# Altium schematic sheet Power.SchDoc
size A4
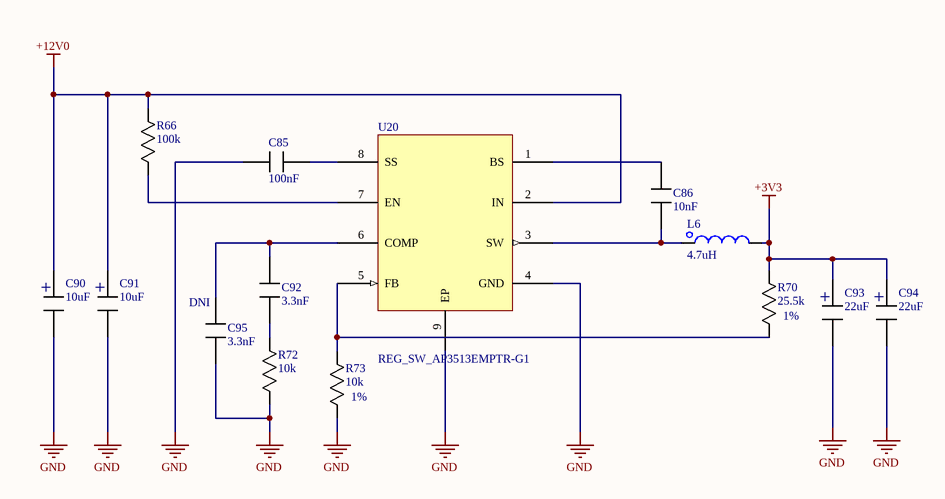
[diagram p0: Power.SchDoc]

## Parts
C85  value 100nF  [0603]  (hidden comment: Capacitor)
C86  value 10nF  [0603]  (hidden comment: Capacitor)
C90  value 10uF  [CAP_RAD_SMD_DIA157]  (hidden comment: Capacitor_Polarized)
C91  value 10uF  [CAP_RAD_SMD_DIA157]  (hidden comment: Capacitor_Polarized)
C92  value 3.3nF  [0603]  (hidden comment: Capacitor)
C93  value 22uF  [CAP_RAD_SMD_DIA157]  (hidden comment: Capacitor_Polarized)
C94  value 22uF  [CAP_RAD_SMD_DIA157]  (hidden comment: Capacitor_Polarized)
C95  value 3.3nF  note: DNI  [0603]  (hidden comment: Capacitor)
L6  value 4.7uH  [SRN5040-4R7M]  (hidden comment: Inductor)
R66  value 100k  [0603]  (hidden comment: Resistor)
R70  value 25.5k  Tolerance: 1%  [0603]  (hidden comment: Resistor)
R72  value 10k  [0603]  (hidden comment: Resistor)
R73  value 10k  Tolerance: 1%  [0603]  (hidden comment: Resistor)
U20  REG_SW_AP3513EMPTR-G1  [AP3513EMPTR-G1]

## Nets
+3V3: C93.+ C94.+ L6.2 R70.1
+12V0: C90.+ C91.+ R66.2 U20.2(IN)
GND: C85.1 C90.- C91.- C93.- C94.- C95.2 R72.2 R73.2 U20.4(GND) U20.9(EP)
NetC85_2: C85.2 U20.8(SS)
NetC86_1: C86.1 U20.1(BS)
NetC86_2: C86.2 L6.1 U20.3(SW)
NetC92_1: C92.1 C95.1 U20.6(COMP)
NetC92_2: C92.2 R72.1
NetR66_1: R66.1 U20.7(EN)
NetR70_2: R70.2 R73.1 U20.5(FB)

## Library data of the parts
C85 = Capacitor: Mfg: Samsung; Mfg_PN: CL10F104ZO8NNNC; HelpURL: *; NI: NI; Supplier1: Digikey; Supplier1_PN: 1276-1258-1-ND; Tolerance: *; Type: *; Rating: *
C86 = Capacitor: Mfg: Samsung; Mfg_PN: CL10B102KB8NNNC; HelpURL: https://www.digikey.ca/product-detail/en/samsung-electro-mechanics/CL10B102KB8NNNC/1276-1018-1-ND/3889104; NI: NI; Supplier1: Digikey; Supplier1_PN: 1276-1018-1-ND; Tolerance: *; Type: *; Rating: *
C90 C91 C93 C94 = Capacitor_Polarized: Capacitor; Mfg: Nichicon; Mfg_PN: UWX1C100MCL1GB; HelpURL: *; NI: *; Supplier1: Digikey; Supplier1_PN: 493-2100-1-ND; Tolerance: *; Type: *; Rating: *
C92 C95 = Capacitor: Mfg: Samsung; Mfg_PN: CL10B332JB8NNNC; HelpURL: *; NI: NI; Supplier1: Digikey; Supplier1_PN: 1276-2030-1-ND; Tolerance: *; Type: *; Rating: *
L6 = Inductor: Mfg: Bourns Inc.; HelpURL: *; Mfg_PN: SRN5040-4R7M; NI: *; Rating: *; Tolerance: *; Supplier1: Digikey; Supplier1_PN: SRN5040-4R7MCT-ND
R66 = Resistor: Mfg: Stackpole Electronics Inc; Mfg_PN: RMCF0603FT100K; HelpURL: https://www.digikey.ca/product-detail/en/stackpole-electronics-inc/RMCF0603FT100K/RMCF0603FT100KCT-ND/1943118; NI: *; Supplier1: Digikey; Supplier1_PN: RMCF0603FT100KCT-ND; Type: *; Rating: *; Tolerance: *
R70 = Resistor: Mfg: Stackpole Electronics Inc; Mfg_PN: RMCF0603FT25K5; HelpURL: *; NI: *; Supplier1: Digikey; Supplier1_PN: RMCF0603FT25K5CT-ND; Type: *; Rating: *
R72 = Resistor: Mfg: Yageo; Mfg_PN: RC0603JR-0710KL; HelpURL: *; NI: *; Supplier1: Digikey; Supplier1_PN: 311-10KGRCT-ND; Type: *; Rating: *; Tolerance: *
R73 = Resistor: Mfg: Stackpole Electronics Inc; Mfg_PN: RNCP0603FTD10K0; HelpURL: *; NI: *; Supplier1: Digikey; Supplier1_PN: RNCP0603FTD10K0CT-ND; Type: *; Rating: *
U20 = REG_SW_AP3513EMPTR-G1: Mfg: Diodes Incorporated; CreatedBy: Emile Laplante; HelpURL: https://www.digikey.ca/product-detail/en/diodes-incorporated/AP3513EMPTR-G1/AP3513EMPTR-G1DICT-ND/4505181; Mfg Part Number: AP3513EMPTR-G1; NI: *; Power: *; Supplier: Digikey; Supplier Part Numer: AP3513EMPTR-G1DICT-ND; Temperature: *; Value: *; VerifiedBy: *; Voltage: *